# Altium schematic sheet Clocks.SchDoc: =SheetTitle_Top
size 420 x 297 mm; EDA_Number: ARTIQ; Author: G.Kasprowicz; CompanyName: WUT ISE; DrawnBy: G.Kasprowicz; Organization: WUT ISE; Address1: PW ISE; Address2: Nowowiejska 15/19 00-665 Warsaw; Address3: gkasprow@gmail.com; ModifiedBy: -; CheckedDate: -; Title2: Clocks; DivGrp: WUT ISE; Designer: G.Kasprowicz; ModifiedDate: -; ProjectName: Sensor Box
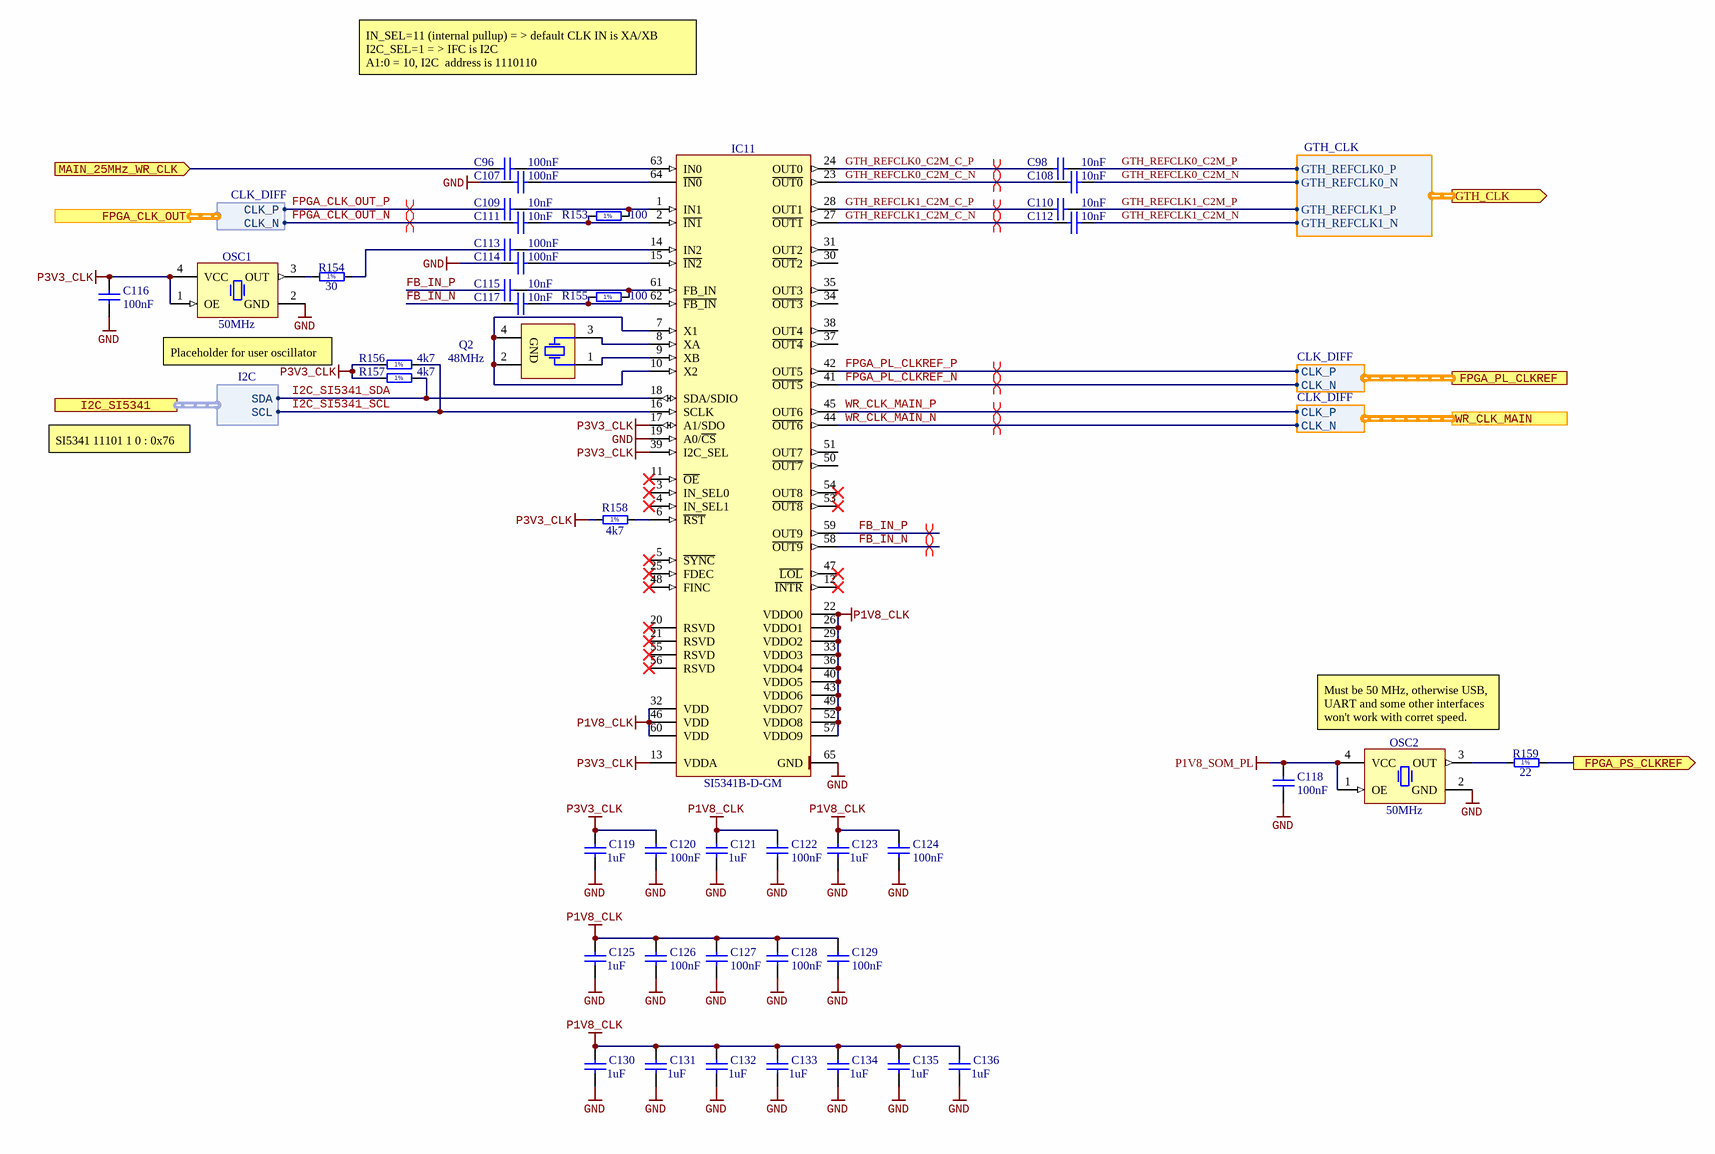
[diagram p0: Clocks.SchDoc]

## Parts
C96  100nF  [CAPC1005X55N]
C98  10nF  [CAPC1005X55N]
C107  100nF  [CAPC1005X55N]
C108  10nF  [CAPC1005X55N]
C109  10nF  [CAPC1005X55N]
C110  10nF  [CAPC1005X55N]
C111  10nF  [CAPC1005X55N]
C112  10nF  [CAPC1005X55N]
C113  100nF  [CAPC1005X55N]
C114  100nF  [CAPC1005X55N]
C115  10nF  [CAPC1005X55N]
C116  100nF  [CAPC1005X55N]
C117  10nF  [CAPC1005X55N]
C118  100nF  [CAPC1005X55N]
C119  1uF  [CAPC1005X55N]
C120  100nF  [CAPC1005X55N]
C121  1uF  [CAPC1005X55N]
C122  100nF  [CAPC1005X55N]
C123  1uF  [CAPC1005X55N]
C124  100nF  [CAPC1005X55N]
C125  1uF  [CAPC1005X55N]
C126  100nF  [CAPC1005X55N]
C127  100nF  [CAPC1005X55N]
C128  100nF  [CAPC1005X55N]
C129  100nF  [CAPC1005X55N]
C130  1uF  [CAPC1005X55N]
C131  1uF  [CAPC1005X55N]
C132  1uF  [CAPC1005X55N]
C133  1uF  [CAPC1005X55N]
C134  1uF  [CAPC1005X55N]
C135  1uF  [CAPC1005X55N]
C136  1uF  [CAPC1005X55N]
IC11  SI5341B-D-GM  [QFN50P900X900X90-65N-S530]
OSC1  50MHz  [OSC_EPSON_SG-8018CE]
OSC2  50MHz  [OSC_EPSON_SG-8018CE]
Q2  48MHz  [XTAL_TXC_7M]
R153  100  [RESC1005X40N]
R154  30  [RESC1005X40N]
R155  100  [RESC1005X40N]
R156  4k7  [RESC1005X40N]
R157  4k7  [RESC1005X40N]
R158  4k7  [RESC1005X40N]
R159  22  [RESC1005X40N]

## Ports
FPGA_CLK_OUT (harness CLK_DIFF), FPGA_PL_CLKREF (harness CLK_DIFF), FPGA_PS_CLKREF (out), GTH_CLK (out, harness GTH_CLK), I2C_SI5341 (harness I2C), MAIN_25MHz_WR_CLK (in), WR_CLK_MAIN (harness CLK_DIFF)

## Harnesses
GTH_CLK: GTH_REFCLK0_P, GTH_REFCLK0_N, GTH_REFCLK1_P, GTH_REFCLK1_N
I2C: SCL, SDA
CLK_DIFF: CLK_N, CLK_P
CLK_DIFF: CLK_P, CLK_N

## Nets
GND: C107.2 C114.2 C116.1 C118.1 C119.1 C120.1 C121.1 C122.1 C123.1 C124.1 C125.1 C126.1 C127.1 C128.1 C129.1 C130.1 C131.1 C132.1 C133.1 C134.1 C135.1 C136.1 IC11.19(A0/~{CS}) IC11.65(GND) OSC1.2(GND) OSC2.2(GND)
P1V8_CLK: C121.2 C122.2 C123.2 C124.2 C125.2 C126.2 C127.2 C128.2 C129.2 C130.2 C131.2 C132.2 C133.2 C134.2 C135.2 C136.2 IC11.22(VDDO0) IC11.26(VDDO1) IC11.29(VDDO2) IC11.32(VDD) IC11.33(VDDO3) IC11.36(VDDO4) IC11.40(VDDO5) IC11.43(VDDO6) IC11.46(VDD) IC11.49(VDDO7) IC11.52(VDDO8) IC11.57(VDDO9) IC11.60(VDD)
P1V8_SOM_PL: C118.2 OSC2.1(OE) OSC2.4(VCC)
P3V3_CLK: C116.2 C119.2 C120.2 IC11.13(VDDA) IC11.17(A1/SDO) IC11.39(I2C_SEL) OSC1.1(OE) OSC1.4(VCC) R156.1 R157.1 R158.1
FB_IN_N: C117.2 IC11.58(~{OUT9})
FB_IN_P: C115.2 IC11.59(OUT9)
FPGA_CLK_OUT_N: C111.2 ; port FPGA_CLK_OUT.CLK_N
FPGA_CLK_OUT_P: C109.2 ; port FPGA_CLK_OUT.CLK_P
FPGA_PL_CLKREF_N: IC11.41(~{OUT5}) ; port FPGA_PL_CLKREF.CLK_N
FPGA_PL_CLKREF_P: IC11.42(OUT5) ; port FPGA_PL_CLKREF.CLK_P
FPGA_PS_CLKREF: R159.2 ; port FPGA_PS_CLKREF
GTH_REFCLK0_C2M_C_N: C108.2 IC11.23(~{OUT0})
GTH_REFCLK0_C2M_C_P: C98.2 IC11.24(OUT0)
GTH_REFCLK0_C2M_N: C108.1 ; port GTH_CLK.GTH_REFCLK0_N
GTH_REFCLK0_C2M_P: C98.1 ; port GTH_CLK.GTH_REFCLK0_P
GTH_REFCLK1_C2M_C_N: C112.2 IC11.27(~{OUT1})
GTH_REFCLK1_C2M_C_P: C110.2 IC11.28(OUT1)
GTH_REFCLK1_C2M_N: C112.1 ; port GTH_CLK.GTH_REFCLK1_N
GTH_REFCLK1_C2M_P: C110.1 ; port GTH_CLK.GTH_REFCLK1_P
I2C_SI5341_SCL: IC11.16(SCLK) R156.2 ; port I2C_SI5341.SCL
I2C_SI5341_SDA: IC11.18(SDA/SDIO) R157.2 ; port I2C_SI5341.SDA
MAIN_25MHz_WR_CLK: C96.2 ; port MAIN_25MHz_WR_CLK
WR_CLK_MAIN_N: IC11.44(~{OUT6}) ; port WR_CLK_MAIN.CLK_N
WR_CLK_MAIN_P: IC11.45(OUT6) ; port WR_CLK_MAIN.CLK_P
NetC96_1: C96.1 IC11.63(IN0)
NetC107_1: C107.1 IC11.64(~{IN0})
NetC109_1: C109.1 IC11.1(IN1) R153.2
NetC111_1: C111.1 IC11.2(~{IN1}) R153.1
NetC113_1: C113.1 IC11.14(IN2)
NetC113_2: C113.2 R154.2
NetC114_1: C114.1 IC11.15(~{IN2})
NetC115_1: C115.1 IC11.61(FB_IN) R155.2
NetC117_1: C117.1 IC11.62(~{FB_IN}) R155.1
NetIC11_6: IC11.6(~{RST}) R158.2
NetIC11_7: IC11.7(X1) IC11.10(X2) Q2.2(GND) Q2.4(GND)
NetIC11_8: IC11.8(XA) Q2.3(X)
NetIC11_9: IC11.9(XB) Q2.1(X)
NetOSC1_3: OSC1.3(OUT) R154.1
NetOSC2_3: OSC2.3(OUT) R159.1

Not connected (* = marked no-connect by the designer): IC11 3(IN_SEL0)* 4(IN_SEL1)* 5(~{SYNC})* 11(~{OE})* 12(~{INTR})* 20(RSVD)* 21(RSVD)* 25(FDEC)* 30(~{OUT}2) 31(OUT2) 34(~{OUT3}) 35(OUT3) 37(~{OUT4}) 38(OUT4) 47(~{LOL})* 48(FINC)* 50(~{OUT7}) 51(OUT7) 53(~{OUT8})* 54(OUT8)* 55(RSVD)* 56(RSVD)*

## Layout directives
differential pair: FB_IN_N, FB_IN_P, FPGA_CLK_OUT_N, FPGA_CLK_OUT_P, FPGA_PL_CLKREF_N, FPGA_PL_CLKREF_P, GTH_REFCLK0_C2M_C_N, GTH_REFCLK0_C2M_C_P, GTH_REFCLK1_C2M_C_N, GTH_REFCLK1_C2M_C_P, WR_CLK_MAIN_N, WR_CLK_MAIN_P

## Notes on the sheet
- IN_SEL=11 (internal pullup) = > default CLK IN is XA/XB
  I2C_SEL=1 = > IFC is I2C
  A1:0 = 10, I2C  address is 1110110
- (near OSC1) Placeholder for user oscillator
- SI5341 11101 1 0 : 0x76
- Must be 50 MHz, otherwise USB, UART and some other interfaces won't work with corret speed.
- Project/Equipment
- Document
- Designer
- Drawn by
- Check.by
- Copyright WUT ISE 2020.
  This documentation describes Open Hardware and is licensed under the CERN OHL v.1.2. You may redistribute and modify this documentation under the terms of the CERN OHL v.1.2. (http://ohwr.org/CERNOHL). This documentation is distributed WITHOUT ANY EXPRESS OR IMPLIED WARRANTY, INCLUDING OF MERCHANTABILITY, SATISFACTORY QUALITY AND FITNESS FOR A PARTICULAR PURPOSE. Please see the CERN OHL v.1.2 for applicable conditions.
- Contact
- File
- Last Mod.
- Print Date
- Sheet
- Size
- A3
- of
- Rev
- (in symbol R0402_4K7_1%_0.0625W_100PPM) 1%
- (in symbol R0402_22R_1%_0.0625W_100PPM) 1%
- (in symbol R0402_30R_1%_0.0625W_100PPM) 1%
- (in symbol R0402_100R_1%_0.0625W_100PPM) 1%

## Library data of the parts
C96 C107 C113 C114 C116 C118 C120 C122 C124 C126-C129 = CC0402_100NF_16V_10%_X5R: Non-polarised capacitor; Part Description: SMD Multilayer Chip Ceramic Capacitor; Manufacturer: GENERIC; Manufacturer1 Part Number: GRM155R61C104KA88D; Voltage: 16V; TC: X5R; Tolerance: ±10%; Part Number: CC0402_100NF_16V_10%_X5R; Component Kind: Standard; Component Type: Standard; Pin Count: 2; Value: 100nF; Status: None; Manufacturer Part Number: CC0402_100NF_16V_10%_X5R; Case: 0402; Mounted: Yes; Socket: No; SMD: Yes; Sense: No; Manufacturer1 Example: MURATA; Manufacturer1 ComponentHeight: 0.55mm; HelpURL: \\cern.ch\dfs\Applications\Altium\Datasheets\CC0402_X5R_MURATA_GRM.pdf; Author: CERN DEM JLC; CreateDate: 10.12.2013; LatestRevisionDate: 10.12.2013
C98 C108-C112 C115 C117 = CC0402_10NF_16V_10%_X7R: Non-polarised capacitor; Part Description: SMD Multilayer Chip Ceramic Capacitor; Manufacturer: GENERIC; Manufacturer1 Part Number: 223878715636; Voltage: 16V; TC: X7R; Tolerance: ±10%; Part Number: CC0402_10NF_16V_10%_X7R; Component Kind: Standard; Component Type: Standard; Pin Count: 2; Value: 10nF; Status: Not Recommended; Manufacturer Part Number: CC0402_10NF_16V_10%_X7R; Case: 0402; Mounted: Yes; Socket: No; SMD: Yes; Sense: No; Manufacturer1 Example: PHYCOMP; Manufacturer1 ComponentHeight: 0.55mm; HelpURL: \\cern.ch\dfs\Applications\Altium\Datasheets\CC0402_X7R_PHYCOMP.pdf; Author: CERN DEM JLC; CreateDate: 03.12.2007; LatestRevisionDate: 03.12.2007
C119 C121 C123 C125 C130-C136 = CC0402_1UF_16V_10%_X5R: Non-polarised capacitor; Part Description: SMD Multilayer Chip Ceramic Capacitor; Manufacturer: GENERIC; Manufacturer1 Part Number: C1005X5R1C105KT; Voltage: 16V; TC: X5R; Tolerance: ±10%; Part Number: CC0402_1UF_16V_10%_X5R; Component Kind: Standard; Component Type: Standard; Pin Count: 2; Value: 1uF; Status: Preferred; Manufacturer Part Number: CC0402_1UF_16V_10%_X5R; Case: 0402; Mounted: Yes; Socket: No; SMD: Yes; Sense: No; Manufacturer1 Example: TDK; Manufacturer1 ComponentHeight: 0.55mm; HelpURL: \\cern.ch\dfs\Applications\Altium\Datasheets\CC0402_X5R_TDK_C.pdf; Author: CERN DEM JLC; CreateDate: 2012-10-25; LatestRevisionDate: 2012-10-25
IC11 = SI5341B-D-GM: Low-Jitter, 10-Output, Any-Frequency, Any-Output Clock Generator; Manufacturer: SILICON LABS; PressFit: No; Bonding: No; Part Number: SI5341B-D-GM; Component Kind: Standard; Component Type: Standard; Device: SI5341B-D-GM; PackageDescription: QFN, 0.50mm Pitch, Square; 64 Pin, 9.00mm L X 9.00mm W X 0.90mm H body (w/Thermal Tab 5.30 X 5.30mm), IPC Medium Density; Part Description: Low-Jitter, 10-Output, Any-Frequency, Any-Output Clock Generator; Manufacturer Part Number: SI5341B-D-GM; Pin Count: 65; Case: QFN64; Mounted: Yes; Socket: No; SMD: Yes; Sense: No; ComponentHeight: 0.9mm; Author: CERN DEM BC; HelpURL: \\cern.ch\dfs\Applications\Altium\Datasheets\SI5341B-D-GM.pdf; CreateDate: 26/02/2020; LatestRevisionDate: 26/02/2020
OSC1 OSC2 = OSC_50MHZ_EPSON_SG-8018CE: Oscillator 4 pins 1=OE 2=GND 3=OUT 4=VCC; Part Description: 1.6 to 3.6V, ±50ppm, 15pF, -40 to 105°C, CMOS Surface Programmable Crystal Oscillator (SG-8018CE Series); Manufacturer: EPSON SEIKO; Manufacturer Part Number: SG-8018CE 50.0000M-TJHPA3; PressFit: No; Bonding: No; Part Number: OSC_50MHZ_EPSON_SG-8018CE; Component Kind: Standard; Component Type: Standard; PackageDescription: Oscillator, Corner Concave; 4 Pin, 2.50mm L X 3.20mm W X 1.20mm H; Value: 50MHz; Pin Count: 4; Mounted: Yes; Socket: No; SMD: Yes; Sense: No; ComponentHeight: 1.2mm; HelpURL: \\cern.ch\dfs\Applications\Altium\Datasheets\OSC_EPSON_SG-8018CE.pdf; Author: CERN DEM BC; CreateDate: 11.08.2021; LatestRevisionDate: 11.08.2021
Q2 = XTAL_48MHZ_TXC_7M-48.000MAHV: Crystal 4 pins 1=XTAL Control 2=GND3=XTAL 4=GND; Part Description: ±30ppm, 8pF, -40°C to +85°C  4 Pins, 3.2x2.5X0.8mm, SMD Sealing Crystal, 7M Series; Manufacturer: TXC CORPORATION; PressFit: No; Bonding: No; Part Number: XTAL_48MHZ_TXC_7M-48.000MAHV; Component Kind: Standard; Component Type: Standard; PackageDescription: 4 Pins, 2.5x3.2mm, SMD Sealing Crystal, 7M Serie; Value: 48MHz; Manufacturer Part Number: 7M-48.000MAHV; Pin Count: 4; Mounted: Yes; Socket: No; SMD: Yes; Sense: No; ComponentHeight: 0.8mm; HelpURL: \\cern.ch\dfs\Applications\Altium\Datasheets\XTAL_TXC_7M.pdf; Author: CERN DEM MR; CreateDate: 30-May-16; LatestRevisionDate: 30-May-16
R153 R155 = R0402_100R_1%_0.0625W_100PPM: Resistor - 1%; Part Description: General Purpose Thick Film Chip Resistor; Manufacturer: GENERIC; Manufacturer1 Part Number: 232270671001L; TC: ±100ppm/°C; PressFit: No; Part Number: R0402_100R_1%_0.0625W_100PPM; Component Kind: Standard; Component Type: Standard; Pin Count: 2; Value: 100; Status: Not Recommended; Power: 0.0625W; Tolerance: ±1%; Manufacturer Part Number: R0402_100R_1%_0.0625W_100PPM; Case: 0402; Mounted: Yes; Sense: No; Socket: No; SMD: Yes; Manufacturer1 Example: YAGEO PHYCOMP; Manufacturer1 ComponentHeight: 0.4mm; HelpURL: \\cern.ch\dfs\Applications\Altium\Datasheets\R0402_Phycomp_RC0402.pdf; Author: CERN DEM JLC; CreateDate: 03.12.2007; LatestRevisionDate: 17.10.2012
R154 = R0402_30R_1%_0.0625W_100PPM: Resistor - 1%; Part Description: General Purpose Thick Film Chip Resistor; Manufacturer: GENERIC; Manufacturer1 Part Number: 232270673009L; TC: ±100ppm/°C; PressFit: No; Part Number: R0402_30R_1%_0.0625W_100PPM; Component Kind: Standard; Component Type: Standard; Pin Count: 2; Value: 30; Status: Not Recommended; Power: 0.0625W; Tolerance: ±1%; Manufacturer Part Number: R0402_30R_1%_0.0625W_100PPM; Case: 0402; Mounted: Yes; Sense: No; Socket: No; SMD: Yes; Manufacturer1 Example: YAGEO PHYCOMP; Manufacturer1 ComponentHeight: 0.4mm; HelpURL: \\cern.ch\dfs\Applications\Altium\Datasheets\R0402_Phycomp_RC0402.pdf; Author: CERN DEM JLC; CreateDate: 03/12/2007; LatestRevisionDate: 17/10/2012
R156-R158 = R0402_4K7_1%_0.0625W_100PPM: Resistor - 1%; Part Description: General Purpose Thick Film Chip Resistor; Manufacturer: GENERIC; Manufacturer1 Part Number: 232270674702L; TC: ±100ppm/°C; PressFit: No; Part Number: R0402_4K7_1%_0.0625W_100PPM; Component Kind: Standard; Component Type: Standard; Pin Count: 2; Value: 4k7; Status: Not Recommended; Power: 0.0625W; Tolerance: ±1%; Manufacturer Part Number: R0402_4K7_1%_0.0625W_100PPM; Case: 0402; Mounted: Yes; Sense: No; Socket: No; SMD: Yes; Manufacturer1 Example: YAGEO PHYCOMP; Manufacturer1 ComponentHeight: 0.4mm; HelpURL: \\cern.ch\dfs\Applications\Altium\Datasheets\R0402_Phycomp_RC0402.pdf; Author: CERN DEM JLC; CreateDate: 03-Dec-07; LatestRevisionDate: 17-Oct-12
R159 = R0402_22R_1%_0.0625W_100PPM: Resistor - 1%; Part Description: General Purpose Thick Film Chip Resistor; Manufacturer: GENERIC; Manufacturer1 Part Number: 232270672209L; TC: ±100ppm/°C; PressFit: No; Part Number: R0402_22R_1%_0.0625W_100PPM; Component Kind: Standard; Component Type: Standard; Pin Count: 2; Value: 22; Status: Not Recommended; Power: 0.0625W; Tolerance: ±1%; Manufacturer Part Number: R0402_22R_1%_0.0625W_100PPM; Case: 0402; Mounted: Yes; Sense: No; Socket: No; SMD: Yes; Manufacturer1 Example: YAGEO PHYCOMP; Manufacturer1 ComponentHeight: 0.4mm; HelpURL: \\cern.ch\dfs\Applications\Altium\Datasheets\R0402_Phycomp_RC0402.pdf; Author: CERN DEM JLC; CreateDate: 03-Dec-07; LatestRevisionDate: 17-Oct-12